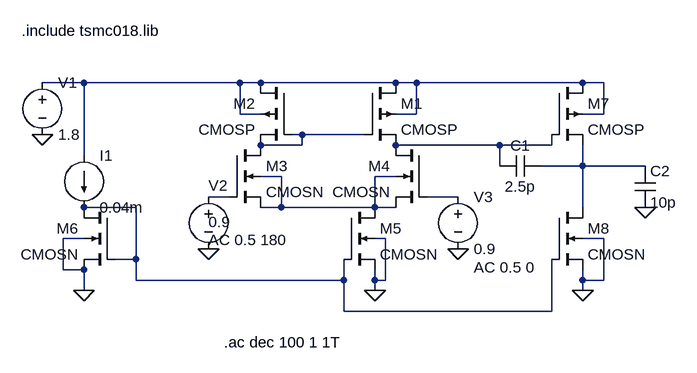
[diagram p0: schematic Opamp2 (2).asc]
Opamp2 (2).asc, the LTspice schematic file:
Version 4
SHEET 1 880 680
WIRE -416 -16 -480 -16
WIRE -176 -16 -416 -16
WIRE -144 -16 -176 -16
WIRE 64 -16 -144 -16
WIRE 96 -16 64 -16
WIRE 352 -16 96 -16
WIRE 384 -16 352 -16
WIRE -176 32 -176 -16
WIRE -144 32 -176 32
WIRE 96 32 96 -16
WIRE 96 32 64 32
WIRE 384 32 384 -16
WIRE 384 32 352 32
WIRE -80 64 -96 64
WIRE 16 64 -80 64
WIRE -80 80 -80 64
WIRE -80 80 -144 80
WIRE 224 80 64 80
WIRE 304 80 304 64
WIRE 304 80 224 80
WIRE -416 96 -416 -16
WIRE 224 112 224 80
WIRE 352 112 352 80
WIRE 352 112 288 112
WIRE 448 112 352 112
WIRE -112 128 -144 128
WIRE 64 128 32 128
WIRE -192 160 -224 160
WIRE 160 160 112 160
WIRE -336 176 -416 176
WIRE -112 176 -112 128
WIRE -112 176 -144 176
WIRE 32 176 32 128
WIRE 32 176 -112 176
WIRE 64 176 32 176
WIRE 352 176 352 112
WIRE -416 224 -448 224
WIRE 48 224 32 224
WIRE 384 224 352 224
WIRE -336 256 -336 176
WIRE -336 256 -368 256
WIRE -448 272 -448 224
WIRE -416 272 -448 272
WIRE -336 288 -336 256
WIRE -16 288 -16 256
WIRE -16 288 -336 288
WIRE 32 288 32 272
WIRE 48 288 48 224
WIRE 48 288 32 288
WIRE 352 288 352 272
WIRE 384 288 384 224
WIRE 384 288 352 288
WIRE -416 304 -416 272
WIRE 32 304 32 288
WIRE 352 304 352 288
WIRE -16 336 -16 288
WIRE 304 336 304 256
WIRE 304 336 -16 336
FLAG -480 64 0
FLAG -224 240 0
FLAG 160 240 0
FLAG 448 176 0
FLAG -416 304 0
FLAG 32 304 0
FLAG 352 304 0
SYMBOL cmosp 16 -16 R0
SYMATTR InstName M1
SYMATTR Value2 l=180n w=882n
SYMBOL cmosp -96 -16 M0
SYMATTR InstName M2
SYMATTR Value2 l=180n w=882n
SYMBOL cmosn -192 80 R0
SYMATTR InstName M3
SYMATTR Value2 l=180n w=1480n
SYMBOL cmosn 112 80 M0
SYMATTR InstName M4
SYMATTR Value2 l=180n w=1480n
SYMBOL cmosn -16 176 R0
SYMATTR InstName M5
SYMATTR Value2 l=180n w=605n
SYMBOL cmosn -368 176 M0
SYMATTR InstName M6
SYMATTR Value2 l=180n w=965n
SYMBOL current -416 96 R0
WINDOW 123 0 0 Left 2
WINDOW 39 0 0 Left 2
SYMATTR InstName I1
SYMATTR Value 0.04m
SYMBOL voltage -480 -32 R0
WINDOW 123 0 0 Left 2
WINDOW 39 0 0 Left 2
SYMATTR InstName V1
SYMATTR Value 1.8
SYMBOL voltage -224 144 R0
WINDOW 123 0 82 Left 2
WINDOW 39 0 0 Left 2
WINDOW 0 0 -2 Left 2
WINDOW 3 0 54 Left 2
SYMATTR Value2 AC 0.5 180
SYMATTR InstName V2
SYMATTR Value 0.9
SYMBOL voltage 160 144 R0
WINDOW 123 24 124 Left 2
WINDOW 39 0 0 Left 2
SYMATTR Value2 AC 0.5 0
SYMATTR InstName V3
SYMATTR Value 0.9
SYMBOL cmosp 304 -16 R0
SYMATTR InstName M7
SYMATTR Value2 l=180n w=22440n
SYMBOL cmosn 304 176 R0
SYMATTR InstName M8
SYMATTR Value2 l=180n w=7680n
SYMBOL cap 288 96 R90
WINDOW 0 0 32 VBottom 2
WINDOW 3 32 32 VTop 2
SYMATTR InstName C1
SYMATTR Value 2.5p
SYMBOL cap 432 112 R0
SYMATTR InstName C2
SYMATTR Value 10p
TEXT -512 -96 Left 2 !.include tsmc018.lib
TEXT -200 384 Left 2 !.ac dec 100 1 1T

The netlist it stands for:
* Opamp2 (2).asc
M1 N001 N002 N003 N001 CMOSP l=180n w=882n
M2 N001 N002 N002 N001 CMOSP l=180n w=882n
M3 N002 N006 N005 N005 CMOSN l=180n w=1480n
M4 N003 N007 N005 N005 CMOSN l=180n w=1480n
M5 N005 N008 0 0 CMOSN l=180n w=605n
M6 N008 N008 0 0 CMOSN l=180n w=965n
I1 N001 N008 0.04m
V1 N001 0 1.8
V2 N006 0 0.9 AC 0.5 180
V3 N007 0 0.9 AC 0.5 0
M7 N001 N003 N004 N001 CMOSP l=180n w=22440n
M8 N004 N008 0 0 CMOSN l=180n w=7680n
C1 N004 N003 2.5p
C2 N004 0 10p
.model NMOS NMOS
.model PMOS PMOS
.lib standard.mos
.include tsmc018.lib
.ac dec 100 1 1T
.backanno
.end